# EAGLE design receiver (EAGLE 6.5.0)
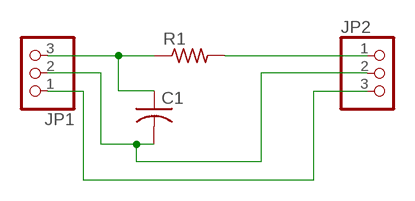
[diagram p0: schematic, sheet 1]

## Parts
C1  C-US025-030X050  [C025-030X050]
JP1  PINHD-1X3  [1X03]
JP2  PINHD-1X3  [1X03]
R1  R-US_0207/12  [0207/12]

## Nets
N$1: C1.1 JP1.3 R1.1
N$2: JP2.1 R1.2
N$3: C1.2 JP1.2 JP2.2
N$5: JP1.1 JP2.3

## Library data of the parts
C1 = rcl:C-US: CAPACITOR, American symbol
JP1 JP2 = pinhead:PINHD-1X3: PIN HEADER
R1 = rcl:R-US_: RESISTOR, American symbol

## Board
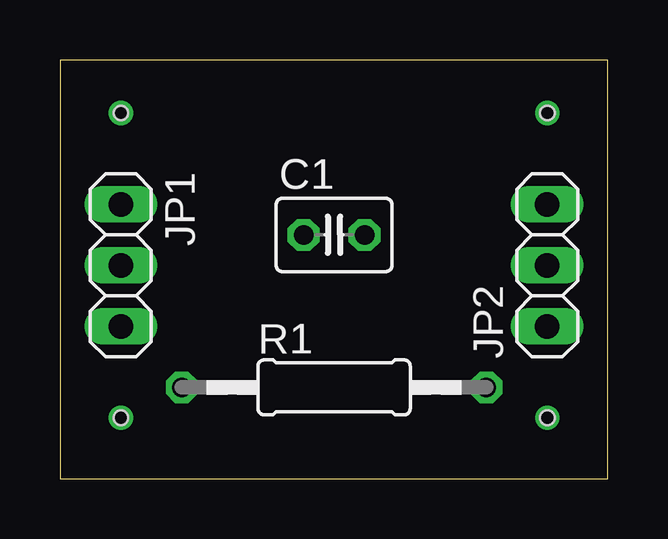
[diagram p1: board, top side]
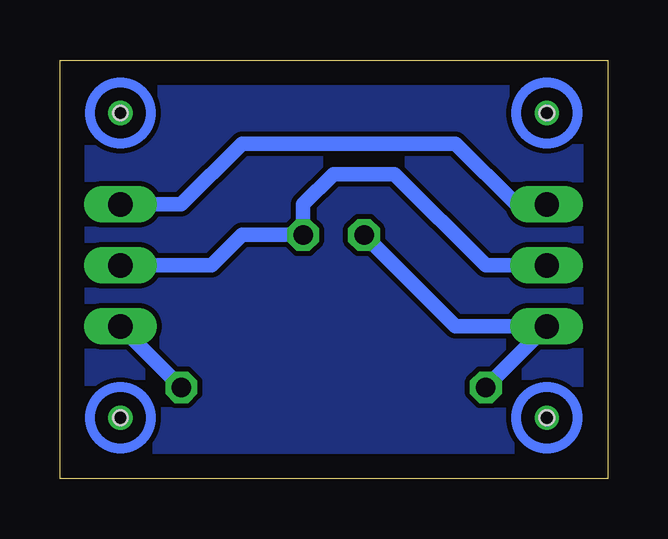
[diagram p2: board, bottom side, seen from below]

Size 22.84 x 17.45 mm. Coordinates in mm from the lower left corner, seen from the top.
Outline: 0,0 22.84,0 22.84,17.45 0,17.45 0,0
Copper layers (1*16): Top 0.035mm / dielectric 1.5mm / Bottom 0.035mm
Design rules "default": minimum track width 10mil, minimum drill 24mil, track to track 8mil, track to pad 8mil, pad to pad 8mil, via to via 8mil, smd to smd 8mil, copper to edge 40mil, drill to drill 8mil, minimum pad ring 10mil, minimum via ring 8mil, stop-mask expansion 4mil, vias tented up to drill 0mil, thermal gap 10mil
Holes 0.6 mm at 2.54,2.54 20.32,2.54 20.32,15.24 2.54,15.24

### Footprints (pad centres in the part's own frame; a part is rotated, then mirrored left to right if it is on the bottom)
C025-030X050 = drill 0.813 octagon: 1 -1.27,0; 2 1.27,0
1X03 = drill 1.016 long: 1 -2.54,0; 2 0,0; 3 2.54,0
0207/12 = drill 0.813 octagon: 1 -6.35,0; 2 6.35,0

### Placement (x,y rotation side)
C1  11.43,10.16 0 top
JP1  2.54,8.89 270 top
JP2  20.32,8.89 90 top
R1  11.43,3.81 0 top

### Tracks (layer width: path | path; a pad name or v marks a point on that pad's centre or on a via)
N$1
  Bottom 0.61: R1.1 JP1.3 6.35,6.35 C1.1
N$2
  Bottom 0.61: R1.2 JP2.1
N$3
  Bottom 0.61: JP2.2 16.51,8.89 15.24,10.16 C1.2 12.7,11.43 11.43,12.7 8.89,12.7 5.08,8.89 JP1.2
N$4  (via drill 0.6)
  other vias: 2.54,2.54
N$5
  Bottom 0.61: JP1.1 3.81,11.43 6.35,13.97 15.24,13.97 17.78,11.43 JP2.3
N$6  (via drill 0.6)
  other vias: 20.32,2.54
N$7  (via drill 0.6)
  other vias: 20.32,15.24
N$8  (via drill 0.6)
  other vias: 2.54,15.24
N$9
  pour Bottom: 0,17.78 22.86,17.78 22.86,0 0,0
(copper drawn outside any net)
  shapes: Bottom circle x4